# Altium schematic sheet Motor Drivers.SchDoc: DC and Stepper Motor
size B; Date: 24-02-04; CheckedBy: Jude Thibeault; Author: Kyle Dick; DrawnBy: Kyle Dick; Engineer: Kyle Dick; Revision: 2; SheetNumber: 2; SheetTotal: 3
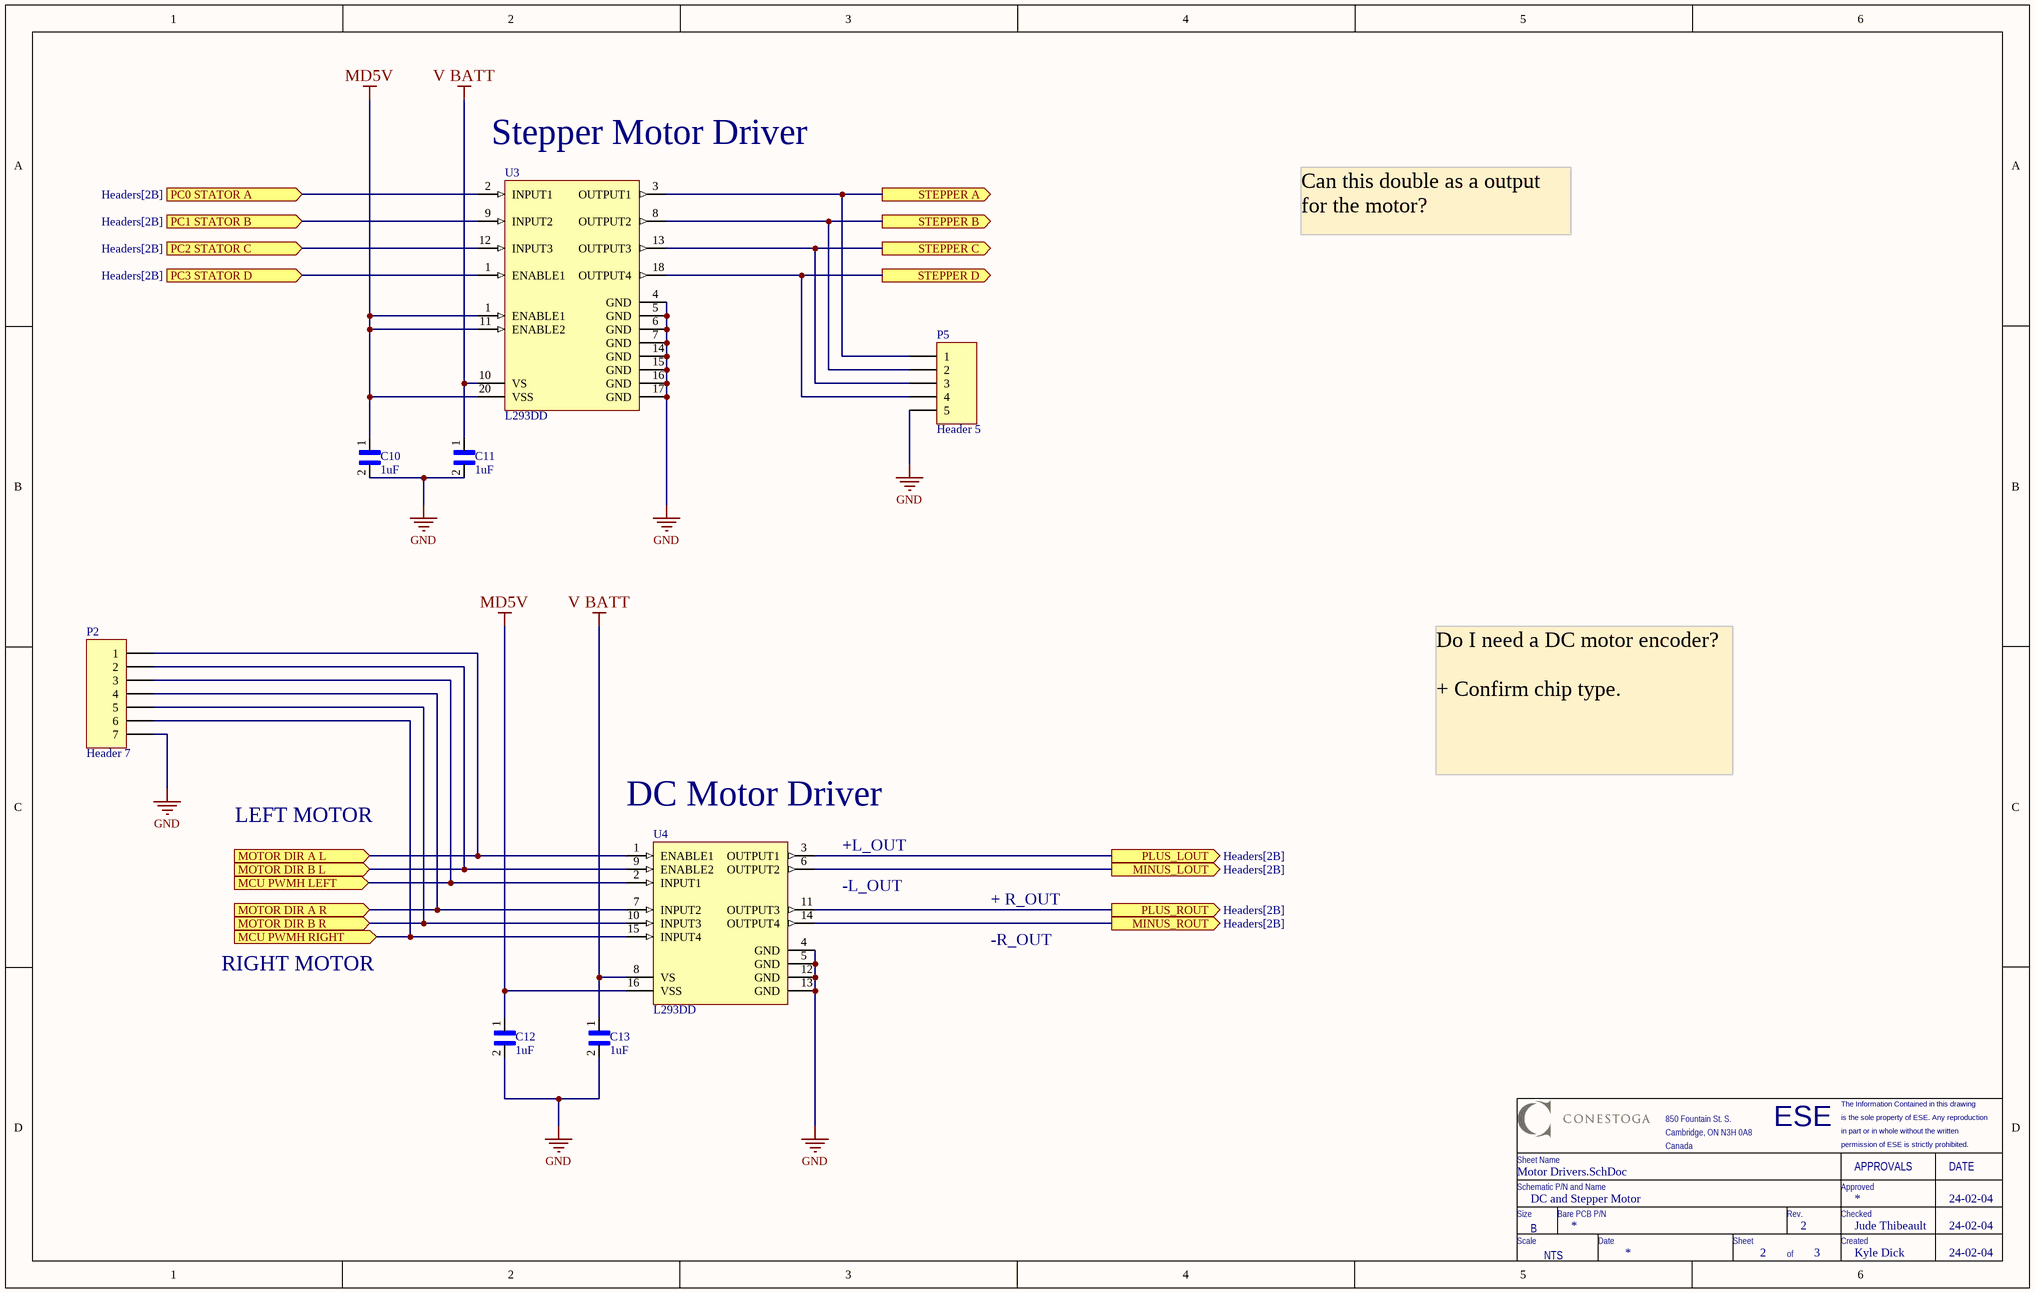
[diagram p0: Motor Drivers.SchDoc]

## Parts
C10  1uF  [10 uF Cap]
C11  1uF  [10 uF Cap]
C12  1uF  [10 uF Cap]
C13  1uF  [10 uF Cap]
P2  Header 7  [HDR1X7]
P5  Header 5  [HDR1X5]
U3  L293DD  [STM-SOIC-20_M]
U4  L293DD  [STM-L293D-16]

## Ports
MCU PWMH LEFT (in, see Headers[2C]), MCU PWMH RIGHT (in, see Headers[2C]), MINUS_LOUT (out, see Headers[2B]), MINUS_ROUT (out, see Headers[2B]), MOTOR DIR A L (in, see Headers[2C]), MOTOR DIR A R (in, see Headers[2C]), MOTOR DIR B L (in, see Headers[2C]), MOTOR DIR B R (in, see Headers[2C]), PC0 STATOR A (in, see Headers[2B]), PC1 STATOR B (in, see Headers[2B]), PC2 STATOR C (in, see Headers[2B]), PC3 STATOR D (in, see Headers[2B]), PLUS_LOUT (out, see Headers[2B]), PLUS_ROUT (out, see Headers[2B]), STEPPER A (out, see Headers[2A]), STEPPER B (out, see Headers[2A]), STEPPER C (out, see Headers[2A]), STEPPER D (out, see Headers[2A])

## Nets
GND: C10.2 C11.2 C12.2 C13.2 P2.7 P5.5 U3.4(GND) U3.5(GND) U3.6(GND) U3.7(GND) U3.14(GND) U3.15(GND) U3.16(GND) U3.17(GND) U4.4(GND) U4.5(GND) U4.12(GND) U4.13(GND)
MD5V: C10.1 C12.1 U3.1(ENABLE1) U3.11(ENABLE2) U3.20(VSS) U4.16(VSS)
V BATT: C11.1 C13.1 U3.10(VS) U4.8(VS)
MCU PWMH LEFT: P2.3 U4.2(INPUT1) ; port MCU PWMH LEFT
MCU PWMH RIGHT: P2.6 U4.15(INPUT4) ; port MCU PWMH RIGHT
MINUS_LOUT: U4.6(OUTPUT2) ; port MINUS_LOUT
MINUS_ROUT: U4.14(OUTPUT4) ; port MINUS_ROUT
MOTOR DIR A L: P2.1 U4.1(ENABLE1) ; port MOTOR DIR A L
MOTOR DIR A R: P2.4 U4.7(INPUT2) ; port MOTOR DIR A R
MOTOR DIR B L: P2.2 U4.9(ENABLE2) ; port MOTOR DIR B L
MOTOR DIR B R: P2.5 U4.10(INPUT3) ; port MOTOR DIR B R
PC0 STATOR A: U3.2(INPUT1) ; port PC0 STATOR A
PC1 STATOR B: U3.9(INPUT2) ; port PC1 STATOR B
PC2 STATOR C: U3.12(INPUT3) ; port PC2 STATOR C
PC3 STATOR D: U3.1(ENABLE1) ; port PC3 STATOR D
PLUS_LOUT: U4.3(OUTPUT1) ; port PLUS_LOUT
PLUS_ROUT: U4.11(OUTPUT3) ; port PLUS_ROUT
STEPPER A: P5.1 U3.3(OUTPUT1) ; port STEPPER A
STEPPER B: P5.2 U3.8(OUTPUT2) ; port STEPPER B
STEPPER C: P5.3 U3.13(OUTPUT3) ; port STEPPER C
STEPPER D: P5.4 U3.18(OUTPUT4) ; port STEPPER D

## Notes on the sheet
- (near U3) Stepper Motor Driver
- Can this double as a output for the motor?
- Do I need a DC motor encoder?
  + Confirm chip type.
- LEFT MOTOR
- (near U4) DC Motor Driver
- +L_OUT
- -L_OUT
- + R_OUT
- RIGHT MOTOR
- -R_OUT
- ESE
- is the sole property of ESE. Any reproduction
- The Information Contained in this drawing
- Schematic P/N and Name
- Sheet Name
- 850 Fountain St. S.
- Cambridge, ON N3H 0A8
- Canada
- Approved
- in part or in whole without the written
- permission of ESE is strictly prohibited.
- APPROVALS
- DATE
- Size
- Scale
- B
- NTS
- Bare PCB P/N
- Date
- Sheet
- Rev.
- Checked
- Created
- of

## Library data of the parts
C10-C13 = Capacitor 1uF: Ceramic Capacitor 1210; MF: Samsung Electro-Mechanics; MP: CL32A106KBJNNNE; Check_prices: https://www.snapeda.com/parts/CL32A106KBJNNNE/Samsung%20Electro-Mechanics/view-part/3598300/?ref=eda; Value: *; SnapEDA_Link: https://www.snapeda.com/parts/CL32A106KBJNNNE/Samsung%20Electro-Mechanics/view-part/3598300/?ref=snap; Package: 1210 Samsung; Availability: Unavailable; Price: None; Supplier 1: Arrow Electronics; Supplier Part Number 1: CL32B105KCJNNNE
P2 = Header 7: Header, 7-Pin Male; MPN: PEC07SFAN; PN: S1212E-07-ND; URL: http://www.digikey.ca/product-detail/en/PEC07SFAN/S1212E-07-ND
P5 = Header 5: Header, 5-Pin Male; MPN: PEC05SFAN; PN: S1212E-05-ND; URL: http://www.digikey.ca/product-detail/en/PEC05SFAN/S1212E-05-ND/859446
U3 = CMP-1771-00003-1: Push-Pull Four Channel Driver with Diodes, 4.5 to 36 V, 20-Pin SOIC, RoHS, Tube; Voltage Rating: 50 V; Power Rating: 100 mW; Case\Package: 0603; Resistance: 15 kohm; Tolerance: 1%; REACH SVHC: Unknown; Case Code (Imperial): 0603; ComponentLink2Description: Datasheet; ComponentLink2URL: http://www.st.com/content/ccc/resource/technical/document/datasheet/04/ac/22/f9/20/5d/43/a1/CD00000059.pdf/files/CD00000059.pdf/jcr:content/translations/en.CD00000059.pdf; Max Operating Temperature: 155 degC; Width: 0.8 mm; ComponentLink1URL: http://www.st.com/; ComponentLink1Description: Manufacturer URL; Length: 1.6 mm; Package Quantity: 5000; RoHSCompliant: true; Height: 0.45 mm; Mount: Surface Mount; PackageDescription: 20-Pin Small Outline Integrated Circuit, Body 12.8 x 7.5 mm, Pitch 1.27 mm; PackageReference: SOIC-20; Packaging: Tape and Reel; Min Operating Temperature: -55 degC; Case Code (Metric): 1608; DatasheetVersion: Jul-03
U4 = CMP-2000-06524-1: Push-Pull Four Channel Driver with Diode, 4.5 to 36 V, -40 to 150 degC, 16-Pin PDIP, RoHS, Tube; PartNumber: L293D; Manufacturer: STMicroelectronics; Number of Outputs: 4; Current - Peak Output: 1.2A; Current - Output / Channel: 600mA; Input Type: Non-Inverting; Other Related Documents: L293DViewAllSpecifications; Dynamic Catalog: HalfBridge; Voltage - Supply: 4.5V~36V; Other Names: 497-2936-5; Package / Case: 16-DIP(0.300",7.62mm); Operating Temperature: -40°C~150°C; Datasheet URL: http://www.st.com/st-web-ui/static/active/en/resource/technical/document/datasheet/CD00000059.pdf; Supplier Device Package: 16-PowerDIP; Packaging: Tube; Package Description: 16-Pin Thru-Hole Dual-In-Line, Body 20 x 6.85 mm, Pitch 2.54 mm; Standard Package: 25; Datasheet Version: 07/2003; On-State Resistance: -; Manufacturer URL: http://www.st.com/; Category: IntegratedCircuits(ICs); Family: PMIC-MOSFET,BridgeDrivers-InternalSwitch; Type: HalfBridge; Series: -; Mounting Technology: ThroughHole; Package Reference: DIP-16; Mounting Type: ThroughHole